# EAGLE design Adafruit IS31FL3731 CharliePlex Grid (EAGLE 6.6.0)
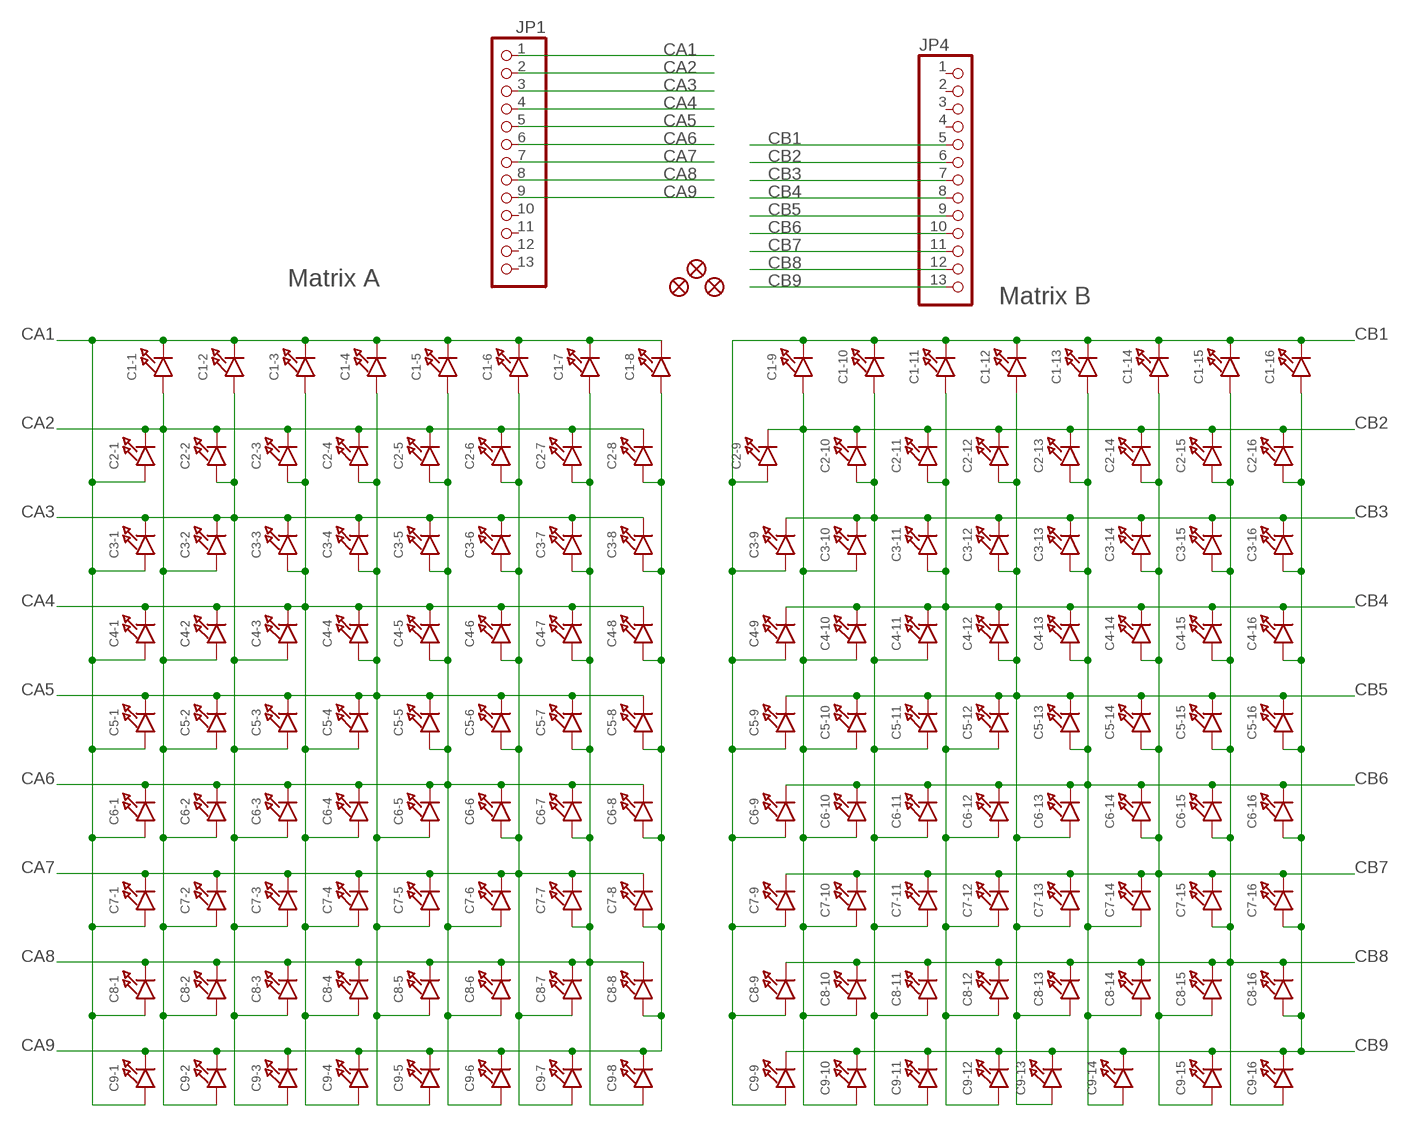
[diagram p0: schematic, sheet 1]

## Parts
C1-1  LED0603_NOOUTLINE  [CHIPLED_0603_NOOUTLINE]
C1-2  LED0603_NOOUTLINE  [CHIPLED_0603_NOOUTLINE]
C1-3  LED0603_NOOUTLINE  [CHIPLED_0603_NOOUTLINE]
C1-4  LED0603_NOOUTLINE  [CHIPLED_0603_NOOUTLINE]
C1-5  LED0603_NOOUTLINE  [CHIPLED_0603_NOOUTLINE]
C1-6  LED0603_NOOUTLINE  [CHIPLED_0603_NOOUTLINE]
C1-7  LED0603_NOOUTLINE  [CHIPLED_0603_NOOUTLINE]
C1-8  LED0603_NOOUTLINE  [CHIPLED_0603_NOOUTLINE]
C1-9  LED0603_NOOUTLINE  [CHIPLED_0603_NOOUTLINE]
C1-10  LED0603_NOOUTLINE  [CHIPLED_0603_NOOUTLINE]
C1-11  LED0603_NOOUTLINE  [CHIPLED_0603_NOOUTLINE]
C1-12  LED0603_NOOUTLINE  [CHIPLED_0603_NOOUTLINE]
C1-13  LED0603_NOOUTLINE  [CHIPLED_0603_NOOUTLINE]
C1-14  LED0603_NOOUTLINE  [CHIPLED_0603_NOOUTLINE]
C1-15  LED0603_NOOUTLINE  [CHIPLED_0603_NOOUTLINE]
C1-16  LED0603_NOOUTLINE  [CHIPLED_0603_NOOUTLINE]
C2-1  LED0603_NOOUTLINE  [CHIPLED_0603_NOOUTLINE]
C2-2  LED0603_NOOUTLINE  [CHIPLED_0603_NOOUTLINE]
C2-3  LED0603_NOOUTLINE  [CHIPLED_0603_NOOUTLINE]
C2-4  LED0603_NOOUTLINE  [CHIPLED_0603_NOOUTLINE]
C2-5  LED0603_NOOUTLINE  [CHIPLED_0603_NOOUTLINE]
C2-6  LED0603_NOOUTLINE  [CHIPLED_0603_NOOUTLINE]
C2-7  LED0603_NOOUTLINE  [CHIPLED_0603_NOOUTLINE]
C2-8  LED0603_NOOUTLINE  [CHIPLED_0603_NOOUTLINE]
C2-9  LED0603_NOOUTLINE  [CHIPLED_0603_NOOUTLINE]
C2-10  LED0603_NOOUTLINE  [CHIPLED_0603_NOOUTLINE]
C2-11  LED0603_NOOUTLINE  [CHIPLED_0603_NOOUTLINE]
C2-12  LED0603_NOOUTLINE  [CHIPLED_0603_NOOUTLINE]
C2-13  LED0603_NOOUTLINE  [CHIPLED_0603_NOOUTLINE]
C2-14  LED0603_NOOUTLINE  [CHIPLED_0603_NOOUTLINE]
C2-15  LED0603_NOOUTLINE  [CHIPLED_0603_NOOUTLINE]
C2-16  LED0603_NOOUTLINE  [CHIPLED_0603_NOOUTLINE]
C3-1  LED0603_NOOUTLINE  [CHIPLED_0603_NOOUTLINE]
C3-2  LED0603_NOOUTLINE  [CHIPLED_0603_NOOUTLINE]
C3-3  LED0603_NOOUTLINE  [CHIPLED_0603_NOOUTLINE]
C3-4  LED0603_NOOUTLINE  [CHIPLED_0603_NOOUTLINE]
C3-5  LED0603_NOOUTLINE  [CHIPLED_0603_NOOUTLINE]
C3-6  LED0603_NOOUTLINE  [CHIPLED_0603_NOOUTLINE]
C3-7  LED0603_NOOUTLINE  [CHIPLED_0603_NOOUTLINE]
C3-8  LED0603_NOOUTLINE  [CHIPLED_0603_NOOUTLINE]
C3-9  LED0603_NOOUTLINE  [CHIPLED_0603_NOOUTLINE]
C3-10  LED0603_NOOUTLINE  [CHIPLED_0603_NOOUTLINE]
C3-11  LED0603_NOOUTLINE  [CHIPLED_0603_NOOUTLINE]
C3-12  LED0603_NOOUTLINE  [CHIPLED_0603_NOOUTLINE]
C3-13  LED0603_NOOUTLINE  [CHIPLED_0603_NOOUTLINE]
C3-14  LED0603_NOOUTLINE  [CHIPLED_0603_NOOUTLINE]
C3-15  LED0603_NOOUTLINE  [CHIPLED_0603_NOOUTLINE]
C3-16  LED0603_NOOUTLINE  [CHIPLED_0603_NOOUTLINE]
C4-1  LED0603_NOOUTLINE  [CHIPLED_0603_NOOUTLINE]
C4-2  LED0603_NOOUTLINE  [CHIPLED_0603_NOOUTLINE]
C4-3  LED0603_NOOUTLINE  [CHIPLED_0603_NOOUTLINE]
C4-4  LED0603_NOOUTLINE  [CHIPLED_0603_NOOUTLINE]
C4-5  LED0603_NOOUTLINE  [CHIPLED_0603_NOOUTLINE]
C4-6  LED0603_NOOUTLINE  [CHIPLED_0603_NOOUTLINE]
C4-7  LED0603_NOOUTLINE  [CHIPLED_0603_NOOUTLINE]
C4-8  LED0603_NOOUTLINE  [CHIPLED_0603_NOOUTLINE]
C4-9  LED0603_NOOUTLINE  [CHIPLED_0603_NOOUTLINE]
C4-10  LED0603_NOOUTLINE  [CHIPLED_0603_NOOUTLINE]
C4-11  LED0603_NOOUTLINE  [CHIPLED_0603_NOOUTLINE]
C4-12  LED0603_NOOUTLINE  [CHIPLED_0603_NOOUTLINE]
C4-13  LED0603_NOOUTLINE  [CHIPLED_0603_NOOUTLINE]
C4-14  LED0603_NOOUTLINE  [CHIPLED_0603_NOOUTLINE]
C4-15  LED0603_NOOUTLINE  [CHIPLED_0603_NOOUTLINE]
C4-16  LED0603_NOOUTLINE  [CHIPLED_0603_NOOUTLINE]
C5-1  LED0603_NOOUTLINE  [CHIPLED_0603_NOOUTLINE]
C5-2  LED0603_NOOUTLINE  [CHIPLED_0603_NOOUTLINE]
C5-3  LED0603_NOOUTLINE  [CHIPLED_0603_NOOUTLINE]
C5-4  LED0603_NOOUTLINE  [CHIPLED_0603_NOOUTLINE]
C5-5  LED0603_NOOUTLINE  [CHIPLED_0603_NOOUTLINE]
C5-6  LED0603_NOOUTLINE  [CHIPLED_0603_NOOUTLINE]
C5-7  LED0603_NOOUTLINE  [CHIPLED_0603_NOOUTLINE]
C5-8  LED0603_NOOUTLINE  [CHIPLED_0603_NOOUTLINE]
C5-9  LED0603_NOOUTLINE  [CHIPLED_0603_NOOUTLINE]
C5-10  LED0603_NOOUTLINE  [CHIPLED_0603_NOOUTLINE]
C5-11  LED0603_NOOUTLINE  [CHIPLED_0603_NOOUTLINE]
C5-12  LED0603_NOOUTLINE  [CHIPLED_0603_NOOUTLINE]
C5-13  LED0603_NOOUTLINE  [CHIPLED_0603_NOOUTLINE]
C5-14  LED0603_NOOUTLINE  [CHIPLED_0603_NOOUTLINE]
C5-15  LED0603_NOOUTLINE  [CHIPLED_0603_NOOUTLINE]
C5-16  LED0603_NOOUTLINE  [CHIPLED_0603_NOOUTLINE]
C6-1  LED0603_NOOUTLINE  [CHIPLED_0603_NOOUTLINE]
C6-2  LED0603_NOOUTLINE  [CHIPLED_0603_NOOUTLINE]
C6-3  LED0603_NOOUTLINE  [CHIPLED_0603_NOOUTLINE]
C6-4  LED0603_NOOUTLINE  [CHIPLED_0603_NOOUTLINE]
C6-5  LED0603_NOOUTLINE  [CHIPLED_0603_NOOUTLINE]
C6-6  LED0603_NOOUTLINE  [CHIPLED_0603_NOOUTLINE]
C6-7  LED0603_NOOUTLINE  [CHIPLED_0603_NOOUTLINE]
C6-8  LED0603_NOOUTLINE  [CHIPLED_0603_NOOUTLINE]
C6-9  LED0603_NOOUTLINE  [CHIPLED_0603_NOOUTLINE]
C6-10  LED0603_NOOUTLINE  [CHIPLED_0603_NOOUTLINE]
C6-11  LED0603_NOOUTLINE  [CHIPLED_0603_NOOUTLINE]
C6-12  LED0603_NOOUTLINE  [CHIPLED_0603_NOOUTLINE]
C6-13  LED0603_NOOUTLINE  [CHIPLED_0603_NOOUTLINE]
C6-14  LED0603_NOOUTLINE  [CHIPLED_0603_NOOUTLINE]
C6-15  LED0603_NOOUTLINE  [CHIPLED_0603_NOOUTLINE]
C6-16  LED0603_NOOUTLINE  [CHIPLED_0603_NOOUTLINE]
C7-1  LED0603_NOOUTLINE  [CHIPLED_0603_NOOUTLINE]
C7-2  LED0603_NOOUTLINE  [CHIPLED_0603_NOOUTLINE]
C7-3  LED0603_NOOUTLINE  [CHIPLED_0603_NOOUTLINE]
C7-4  LED0603_NOOUTLINE  [CHIPLED_0603_NOOUTLINE]
C7-5  LED0603_NOOUTLINE  [CHIPLED_0603_NOOUTLINE]
C7-6  LED0603_NOOUTLINE  [CHIPLED_0603_NOOUTLINE]
C7-7  LED0603_NOOUTLINE  [CHIPLED_0603_NOOUTLINE]
C7-8  LED0603_NOOUTLINE  [CHIPLED_0603_NOOUTLINE]
C7-9  LED0603_NOOUTLINE  [CHIPLED_0603_NOOUTLINE]
C7-10  LED0603_NOOUTLINE  [CHIPLED_0603_NOOUTLINE]
C7-11  LED0603_NOOUTLINE  [CHIPLED_0603_NOOUTLINE]
C7-12  LED0603_NOOUTLINE  [CHIPLED_0603_NOOUTLINE]
C7-13  LED0603_NOOUTLINE  [CHIPLED_0603_NOOUTLINE]
C7-14  LED0603_NOOUTLINE  [CHIPLED_0603_NOOUTLINE]
C7-15  LED0603_NOOUTLINE  [CHIPLED_0603_NOOUTLINE]
C7-16  LED0603_NOOUTLINE  [CHIPLED_0603_NOOUTLINE]
C8-1  LED0603_NOOUTLINE  [CHIPLED_0603_NOOUTLINE]
C8-2  LED0603_NOOUTLINE  [CHIPLED_0603_NOOUTLINE]
C8-3  LED0603_NOOUTLINE  [CHIPLED_0603_NOOUTLINE]
C8-4  LED0603_NOOUTLINE  [CHIPLED_0603_NOOUTLINE]
C8-5  LED0603_NOOUTLINE  [CHIPLED_0603_NOOUTLINE]
C8-6  LED0603_NOOUTLINE  [CHIPLED_0603_NOOUTLINE]
C8-7  LED0603_NOOUTLINE  [CHIPLED_0603_NOOUTLINE]
C8-8  LED0603_NOOUTLINE  [CHIPLED_0603_NOOUTLINE]
C8-9  LED0603_NOOUTLINE  [CHIPLED_0603_NOOUTLINE]
C8-10  LED0603_NOOUTLINE  [CHIPLED_0603_NOOUTLINE]
C8-11  LED0603_NOOUTLINE  [CHIPLED_0603_NOOUTLINE]
C8-12  LED0603_NOOUTLINE  [CHIPLED_0603_NOOUTLINE]
C8-13  LED0603_NOOUTLINE  [CHIPLED_0603_NOOUTLINE]
C8-14  LED0603_NOOUTLINE  [CHIPLED_0603_NOOUTLINE]
C8-15  LED0603_NOOUTLINE  [CHIPLED_0603_NOOUTLINE]
C8-16  LED0603_NOOUTLINE  [CHIPLED_0603_NOOUTLINE]
C9-1  LED0603_NOOUTLINE  [CHIPLED_0603_NOOUTLINE]
C9-2  LED0603_NOOUTLINE  [CHIPLED_0603_NOOUTLINE]
C9-3  LED0603_NOOUTLINE  [CHIPLED_0603_NOOUTLINE]
C9-4  LED0603_NOOUTLINE  [CHIPLED_0603_NOOUTLINE]
C9-5  LED0603_NOOUTLINE  [CHIPLED_0603_NOOUTLINE]
C9-6  LED0603_NOOUTLINE  [CHIPLED_0603_NOOUTLINE]
C9-7  LED0603_NOOUTLINE  [CHIPLED_0603_NOOUTLINE]
C9-8  LED0603_NOOUTLINE  [CHIPLED_0603_NOOUTLINE]
C9-9  LED0603_NOOUTLINE  [CHIPLED_0603_NOOUTLINE]
C9-10  LED0603_NOOUTLINE  [CHIPLED_0603_NOOUTLINE]
C9-11  LED0603_NOOUTLINE  [CHIPLED_0603_NOOUTLINE]
C9-12  LED0603_NOOUTLINE  [CHIPLED_0603_NOOUTLINE]
C9-13  LED0603_NOOUTLINE  [CHIPLED_0603_NOOUTLINE]
C9-14  LED0603_NOOUTLINE  [CHIPLED_0603_NOOUTLINE]
C9-15  LED0603_NOOUTLINE  [CHIPLED_0603_NOOUTLINE]
C9-16  LED0603_NOOUTLINE  [CHIPLED_0603_NOOUTLINE]
FID1  FIDUCIAL""  [FIDUCIAL_1MM]
FID2  FIDUCIAL""  [FIDUCIAL_1MM]
FID3  FIDUCIAL""  [FIDUCIAL_1MM]
JP1  HEADER-1X13  [1X13_ROUND_70]
JP4  HEADER-1X13  [1X13_ROUND_70]

## Nets
CA1: C1-1.C C1-2.C C1-3.C C1-4.C C1-5.C C1-6.C C1-7.C C1-8.C C2-1.A C3-1.A C4-1.A C5-1.A C6-1.A C7-1.A C8-1.A C9-1.A JP1.1
CA2: C1-1.A C2-1.C C2-2.C C2-3.C C2-4.C C2-5.C C2-6.C C2-7.C C2-8.C C3-2.A C4-2.A C5-2.A C6-2.A C7-2.A C8-2.A C9-2.A JP1.2
CA3: C1-2.A C2-2.A C3-1.C C3-2.C C3-3.C C3-4.C C3-5.C C3-6.C C3-7.C C3-8.C C4-3.A C5-3.A C6-3.A C7-3.A C8-3.A C9-3.A JP1.3
CA4: C1-3.A C2-3.A C3-3.A C4-1.C C4-2.C C4-3.C C4-4.C C4-5.C C4-6.C C4-7.C C4-8.C C5-4.A C6-4.A C7-4.A C8-4.A C9-4.A JP1.4
CA5: C1-4.A C2-4.A C3-4.A C4-4.A C5-1.C C5-2.C C5-3.C C5-4.C C5-5.C C5-6.C C5-7.C C5-8.C C6-5.A C7-5.A C8-5.A C9-5.A JP1.5
CA6: C1-5.A C2-5.A C3-5.A C4-5.A C5-5.A C6-1.C C6-2.C C6-3.C C6-4.C C6-5.C C6-6.C C6-7.C C6-8.C C7-6.A C8-6.A C9-6.A JP1.6
CA7: C1-6.A C2-6.A C3-6.A C4-6.A C5-6.A C6-6.A C7-1.C C7-2.C C7-3.C C7-4.C C7-5.C C7-6.C C7-7.C C7-8.C C8-7.A C9-7.A JP1.7
CA8: C1-7.A C2-7.A C3-7.A C4-7.A C5-7.A C6-7.A C7-7.A C8-1.C C8-2.C C8-3.C C8-4.C C8-5.C C8-6.C C8-7.C C8-8.C C9-8.A JP1.8
CA9: C1-8.A C2-8.A C3-8.A C4-8.A C5-8.A C6-8.A C7-8.A C8-8.A C9-1.C C9-2.C C9-3.C C9-4.C C9-5.C C9-6.C C9-7.C C9-8.C JP1.9
CB1: C1-9.C C1-10.C C1-11.C C1-12.C C1-13.C C1-14.C C1-15.C C1-16.C C2-9.A C3-9.A C4-9.A C5-9.A C6-9.A C7-9.A C8-9.A C9-9.A JP4.5
CB2: C1-9.A C2-9.C C2-10.C C2-11.C C2-12.C C2-13.C C2-14.C C2-15.C C2-16.C C3-10.A C4-10.A C5-10.A C6-10.A C7-10.A C8-10.A C9-10.A JP4.6
CB3: C1-10.A C2-10.A C3-9.C C3-10.C C3-11.C C3-12.C C3-13.C C3-14.C C3-15.C C3-16.C C4-11.A C5-11.A C6-11.A C7-11.A C8-11.A C9-11.A JP4.7
CB4: C1-11.A C2-11.A C3-11.A C4-9.C C4-10.C C4-11.C C4-12.C C4-13.C C4-14.C C4-15.C C4-16.C C5-12.A C6-12.A C7-12.A C8-12.A C9-12.A JP4.8
CB5: C1-12.A C2-12.A C3-12.A C4-12.A C5-9.C C5-10.C C5-11.C C5-12.C C5-13.C C5-14.C C5-15.C C5-16.C C6-13.A C7-13.A C8-13.A C9-13.A JP4.9
CB6: C1-13.A C2-13.A C3-13.A C4-13.A C5-13.A C6-9.C C6-10.C C6-11.C C6-12.C C6-13.C C6-14.C C6-15.C C6-16.C C7-14.A C8-14.A C9-14.A JP4.10
CB7: C1-14.A C2-14.A C3-14.A C4-14.A C5-14.A C6-14.A C7-9.C C7-10.C C7-11.C C7-12.C C7-13.C C7-14.C C7-15.C C7-16.C C8-15.A C9-15.A JP4.11
CB8: C1-15.A C2-15.A C3-15.A C4-15.A C5-15.A C6-15.A C7-15.A C8-9.C C8-10.C C8-11.C C8-12.C C8-13.C C8-14.C C8-15.C C8-16.C C9-16.A JP4.12
CB9: C1-16.A C2-16.A C3-16.A C4-16.A C5-16.A C6-16.A C7-16.A C8-16.A C9-9.C C9-10.C C9-11.C C9-12.C C9-13.C C9-14.C C9-15.C C9-16.C JP4.13
Unconnected: JP1.10 JP1.11 JP1.12 JP1.13 JP4.1 JP4.2 JP4.3 JP4.4

## Notes on the sheet
- Matrix A
- Matrix B

## Library data of the parts
C1-1-C1-16 C2-1-C2-16 C3-1-C3-16 C4-1-C4-16 C5-1-C5-16 C6-1-C6-16 C7-1-C7-16 C8-1-C8-16 C9-1-C9-16 = microbuilder:LED: LED 0603 - 0603 Surface Mount Package 2mA: Green LED - Low Power (3.9mcd, 2ma, 1.7Vf) - Digikey: 475-2709-2-ND Orange LED - Low Power (9.8mcd, 2ma, 1.8Vf) - Digikey: 475-1194-2-ND Red LED - Low Power (5mcd, 2ma, 1.8Vf) - Digikey: 475-1195-2-ND Yellow LED - Low Power (7mcd, 2ma, 1.8Vf) - Digikey: 475-1196-2-ND 5mA: Blue LED - Low Power (17mcd, 5ma, 2.9Vf) - Digikey: LNJ937W8CRACT-ND 0805 - 0805 Surface Mount Package 2mA: Red LED (8.8mcd, 2mA, 1.8Vf, Clear) - Low Power [Digikey: 475-2510-1-ND] Green LED (5mcd, 2mA, 1.8Vf, Clear) - Low Power [Digikey: 475-2730-1-ND] Yellow LED (11.3mcd, 2mA, 1.8Vf, Clear) - Low Power [Digikey: 475-2555-1-ND] 20mA: Red LED (104mcd, 20mA, Diffused) - LS R976 [Digikey: 475-1278-6-ND] Red LED (12mcd, 20mA, 2.0Vf, Clear) - APT2012EC [Digikey: 754-1128-1-ND] Green LED (15mcd, 20mA, 2.2Vf, Clear) - APT2012GC [Digikey: 754-1131-1-ND] Orange LED (160mcd, 20mA, 2.1Vf, Clear) - APT2012SECK [Digikey: 754-1130-1-ND] 1206 - 1206 Surface Mount Package Green LED (26mcd, 20mA, Diffused) - LG N971 [Digikey: 475-1407-6-ND] Red LED (15mcd, 20mA, Diffused) - LH N974 [Digikey: 475-1416-6-ND] Cree - Cree High-Power Surface Mount LEDs XPEBWT-L1-0000-00D50 - White 111lm 350mA 2.9Vf 6200K 110° XTEAWT-00-0000-00000LEE3 - White 114lm 350mA 2.85Vf 5000K 115° Everlight - Everlight 45-21 Series Surface Mount LEDs 45-21/QK2C-B2832AC2CB2/2T - Warm White 2000mcd 20mA 3.25Vf 3050K 120° 45-21/LK2C-B38452C4CB2/2T - Nuetral White 2000mcd 20mA 3.25Vf 4150K 120° 45-21/LK2C-B50634C6CB2/2T - Cold White 2200mcd 20mA 3.25Vf 5650K 120° PLCC2 Reverse Mount LS T77K-J1L2-1-0-2-R18-Z - Red 11.25mcd 2mA 1.8Vf 630nm 120° LO T77K-L1M2-24-Z - Orange 19.6mcd 2mA 1.8Vf 606nm 120° LY T77K-K2M1-26-Z - Yellow 15.7mcd 2mA 1.8Vf 587nm 120°
FID1-FID3 = microbuilder:FIDUCIAL: Fiducial Alignment Points Various fiducial points for machine vision alignment.; BOM: EXCLUDE
JP1 JP4 = microbuilder:HEADER-1X13

## Board
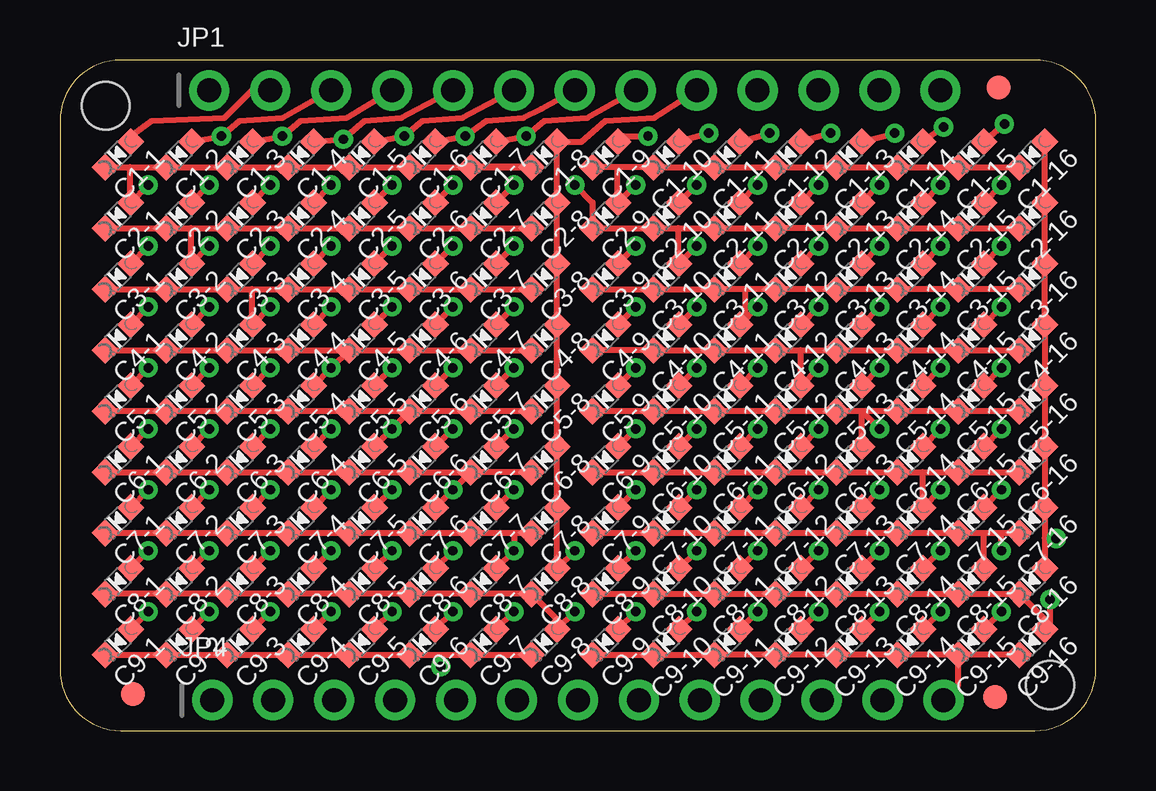
[diagram p1: board, top side]
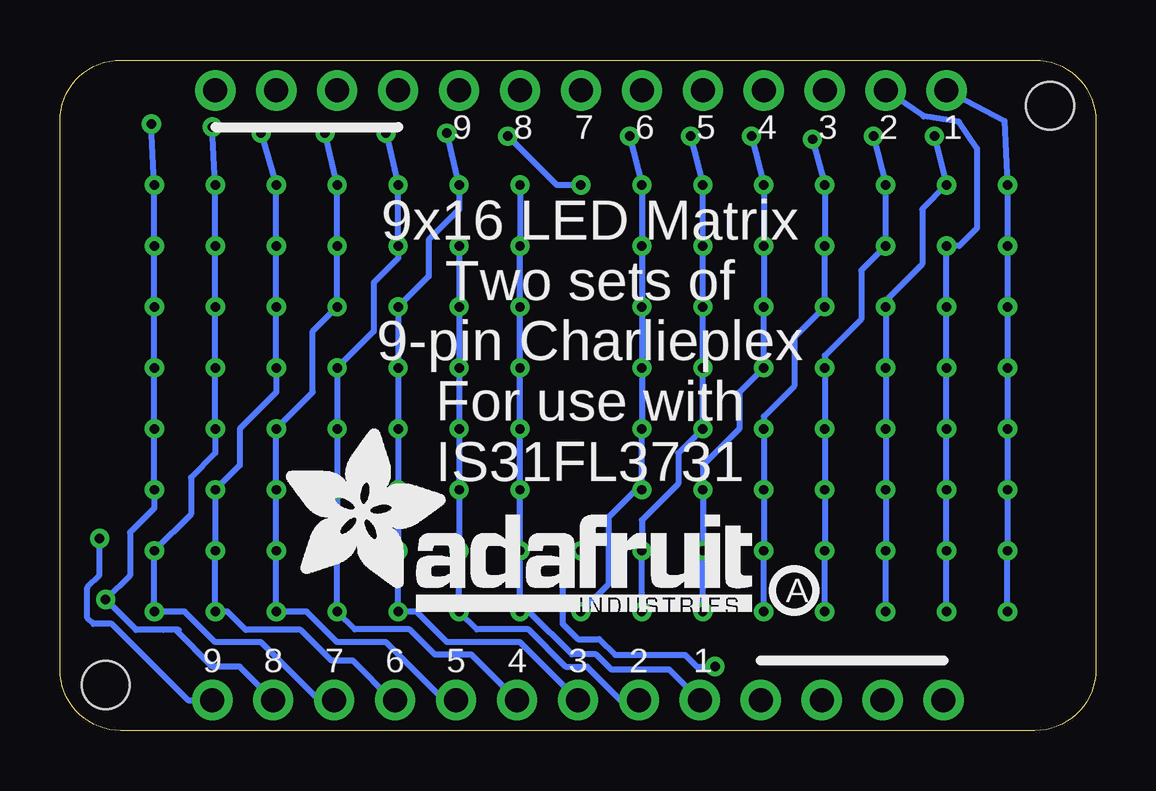
[diagram p2: board, bottom side, seen from below]

Size 43.18 x 27.94 mm. Coordinates in mm from the lower left corner, seen from the top.
Outline: 0,25.4 0,2.54 arc90 2.54,0 40.64,0 arc90 43.18,2.54 43.18,25.4 arc90 40.64,27.94 2.54,27.94 arc90 0,25.4
Copper layers (1*16): Top 0.035mm / dielectric 1.5mm / Bottom 0.035mm
Design rules "adafruit": minimum track width 8mil, minimum drill 15.5mil, track to track 8mil, track to pad 8mil, pad to pad 8mil, via to via 8mil, smd to smd 8mil, copper to edge 10mil, drill to drill 8mil, minimum pad ring 10mil, minimum via ring 8mil, stop-mask expansion 2mil, vias tented up to drill 20mil, thermal gap 10mil
Holes 2 mm at 1.91,26.04 41.27,1.91

### Footprints (pad centres in the part's own frame; a part is rotated, then mirrored left to right if it is on the bottom)
CHIPLED_0603_NOOUTLINE = smd 0.8 x 0.8: A 0,-0.75; C 0,0.75
FIDUCIAL_1MM = smd 1 x 1: 1 0,0
1X13_ROUND_70 = drill 1 pad 1.676: 1 -15.24,0; 2 -12.7,0; 3 -10.16,0; 4 -7.62,0; 5 -5.08,0; 6 -2.54,0; 7 0,0; 8 2.54,0; 9 5.08,0; 10 7.62,0; 11 10.16,0; 12 12.7,0; 13 15.24,0

### Placement (x,y rotation side)
C1-1  2.41,24 135 top
C1-2  4.95,24 135 top
C1-3  7.49,24 135 top
C1-4  10.03,24 135 top
C1-5  12.57,24 135 top
C1-6  15.11,24 135 top
C1-7  17.65,24 135 top
C1-8  20.19,24 135 top
C1-9  22.73,24 135 top
C1-10  25.27,24 135 top
C1-11  27.81,24 135 top
C1-12  30.35,24 135 top
C1-13  32.89,24 135 top
C1-14  35.43,24 135 top
C1-15  37.97,24 135 top
C1-16  40.51,24 135 top
C2-1  2.41,21.46 135 top
C2-2  4.95,21.46 135 top
C2-3  7.49,21.46 135 top
C2-4  10.03,21.46 135 top
C2-5  12.57,21.46 135 top
C2-6  15.11,21.46 135 top
C2-7  17.65,21.46 135 top
C2-8  20.19,21.46 135 top
C2-9  22.73,21.46 135 top
C2-10  25.27,21.46 135 top
C2-11  27.81,21.46 135 top
C2-12  30.35,21.46 135 top
C2-13  32.89,21.46 135 top
C2-14  35.43,21.46 135 top
C2-15  37.97,21.46 135 top
C2-16  40.51,21.46 135 top
C3-1  2.41,18.92 135 top
C3-2  4.95,18.92 135 top
C3-3  7.49,18.92 135 top
C3-4  10.03,18.92 135 top
C3-5  12.57,18.92 135 top
C3-6  15.11,18.92 135 top
C3-7  17.65,18.92 135 top
C3-8  20.19,18.92 135 top
C3-9  22.73,18.92 135 top
C3-10  25.27,18.92 135 top
C3-11  27.81,18.92 135 top
C3-12  30.35,18.92 135 top
C3-13  32.89,18.92 135 top
C3-14  35.43,18.92 135 top
C3-15  37.97,18.92 135 top
C3-16  40.51,18.92 135 top
C4-1  2.41,16.38 135 top
C4-2  4.95,16.38 135 top
C4-3  7.49,16.38 135 top
C4-4  10.03,16.38 135 top
C4-5  12.57,16.38 135 top
C4-6  15.11,16.38 135 top
C4-7  17.65,16.38 135 top
C4-8  20.19,16.38 135 top
C4-9  22.73,16.38 135 top
C4-10  25.27,16.38 135 top
C4-11  27.81,16.38 135 top
C4-12  30.35,16.38 135 top
C4-13  32.89,16.38 135 top
C4-14  35.43,16.38 135 top
C4-15  37.97,16.38 135 top
C4-16  40.51,16.38 135 top
C5-1  2.41,13.84 135 top
C5-2  4.95,13.84 135 top
C5-3  7.49,13.84 135 top
C5-4  10.03,13.84 135 top
C5-5  12.57,13.84 135 top
C5-6  15.11,13.84 135 top
C5-7  17.65,13.84 135 top
C5-8  20.19,13.84 135 top
C5-9  22.73,13.84 135 top
C5-10  25.27,13.84 135 top
C5-11  27.81,13.84 135 top
C5-12  30.35,13.84 135 top
C5-13  32.89,13.84 135 top
C5-14  35.43,13.84 135 top
C5-15  37.97,13.84 135 top
C5-16  40.51,13.84 135 top
C6-1  2.41,11.3 135 top
C6-2  4.95,11.3 135 top
C6-3  7.49,11.3 135 top
C6-4  10.03,11.3 135 top
C6-5  12.57,11.3 135 top
C6-6  15.11,11.3 135 top
C6-7  17.65,11.3 135 top
C6-8  20.19,11.3 135 top
C6-9  22.73,11.3 135 top
C6-10  25.27,11.3 135 top
C6-11  27.81,11.3 135 top
C6-12  30.35,11.3 135 top
C6-13  32.89,11.3 135 top
C6-14  35.43,11.3 135 top
C6-15  37.97,11.3 135 top
C6-16  40.51,11.3 135 top
C7-1  2.41,8.76 135 top
C7-2  4.95,8.76 135 top
C7-3  7.49,8.76 135 top
C7-4  10.03,8.76 135 top
C7-5  12.57,8.76 135 top
C7-6  15.11,8.76 135 top
C7-7  17.65,8.76 135 top
C7-8  20.19,8.76 135 top
C7-9  22.73,8.76 135 top
C7-10  25.27,8.76 135 top
C7-11  27.81,8.76 135 top
C7-12  30.35,8.76 135 top
C7-13  32.89,8.76 135 top
C7-14  35.43,8.76 135 top
C7-15  37.97,8.76 135 top
C7-16  40.51,8.76 135 top
C8-1  2.41,6.22 135 top
C8-2  4.95,6.22 135 top
C8-3  7.49,6.22 135 top
C8-4  10.03,6.22 135 top
C8-5  12.57,6.22 135 top
C8-6  15.11,6.22 135 top
C8-7  17.65,6.22 135 top
C8-8  20.19,6.22 135 top
C8-9  22.73,6.22 135 top
C8-10  25.27,6.22 135 top
C8-11  27.81,6.22 135 top
C8-12  30.35,6.22 135 top
C8-13  32.89,6.22 135 top
C8-14  35.43,6.22 135 top
C8-15  37.97,6.22 135 top
C8-16  40.51,6.22 135 top
C9-1  2.41,3.68 135 top
C9-2  4.95,3.68 135 top
C9-3  7.49,3.68 135 top
C9-4  10.03,3.68 135 top
C9-5  12.57,3.68 135 top
C9-6  15.11,3.68 135 top
C9-7  17.65,3.68 135 top
C9-8  20.19,3.68 135 top
C9-9  22.73,3.68 135 top
C9-10  25.27,3.68 135 top
C9-11  27.81,3.68 135 top
C9-12  30.35,3.68 135 top
C9-13  32.89,3.68 135 top
C9-14  35.43,3.68 135 top
C9-15  37.97,3.68 135 top
C9-16  40.51,3.68 135 top
FID1  39.12,26.8 0 top
FID2  3.05,1.52 0 top
FID3  38.99,1.4 0 top
JP1  21.46,26.67 0 top
JP4  21.59,1.27 0 top
U$1  [PCBFEAT-REV-040]  12.57,5.84 0 bottom
U$2  [ADAFRUIT_TEXT_20MM]  33.91,4.95 0 bottom

### Tracks (layer width: path | path; a pad name or v marks a point on that pad's centre or on a via)
CA1  (via drill 0.39)
  Top 0.254: C1-1.C 2.92,23.47 | 2.92,23.47 C1-2.C C1-3.C C1-4.C C1-5.C C1-6.C C1-7.C | C1-7.C C1-8.C 19.68,23.5 17.14,23.5 C1-7.C | 2.92,23.47 2.92,22.02 C2-1.A v3.68,22.73 | C9-1.A v3.68,4.95 | v3.68,7.49 C8-1.A | C7-1.A v3.68,10.03 | C6-1.A v3.68,12.57 | C5-1.A v3.68,15.11 | C3-1.A v3.68,20.19 | C4-1.A v3.68,17.65
  Bottom 0.254: v3.68,4.95 v3.68,7.49 v3.68,10.03 v3.68,12.57 v3.68,15.11 v3.68,17.65 v3.68,20.19 v3.68,22.73 3.81,25.4 JP1.1
CA2  (via drill 0.39)
  Top 0.254: C2-1.C C2-2.C 5.46,20.93 | 5.46,20.93 C2-3.C C2-4.C C2-5.C C2-6.C C2-7.C C2-8.C | 5.46,20.93 5.46,19.48 C3-2.A v6.22,20.19 | C1-1.A 2.94,24.77 3.83,25.4 6.86,25.53 8,26.67 JP1.2 | C4-2.A v6.22,17.65 | C5-2.A v6.22,15.11 | C6-2.A v6.22,12.57 | C7-2.A v6.22,10.03 | C8-2.A v6.22,7.49 | C9-2.A v6.22,4.95
  Bottom 0.254: v6.22,4.95 v6.22,7.49 v6.22,10.03 v6.22,12.57 v6.22,15.11 v6.22,17.65 v6.22,20.19 5.69,20.19 4.95,20.93 4.95,24.26 5.71,25.36 7.18,25.59 JP1.2
CA3  (via drill 0.39)
  Top 0.254: C3-1.C C3-2.C C3-3.C 8,18.39 | 8,18.39 C3-4.C C3-5.C C3-6.C C3-7.C C3-8.C | 8,18.39 8,16.94 C4-3.A v8.76,17.65 | C1-2.A v6.73,24.77 7.49,25.4 9.27,25.53 JP1.3 | v6.22,22.73 C2-2.A | C9-3.A v8.76,4.95 | v8.76,7.49 C8-3.A | C7-3.A v8.76,10.03 | C6-3.A v8.76,12.57 | C5-3.A v8.76,15.11
  Bottom 0.254: v6.73,24.77 v6.22,22.73 7.24,21.72 7.24,19.43 8.76,17.91 v8.76,17.65 v8.76,15.11 v8.76,12.57 v8.76,10.03 v8.76,7.49 v8.76,4.95
CA4  (via drill 0.39)
  Top 0.254: C4-1.C C4-2.C C4-3.C C4-4.C C4-5.C | C4-5.C C4-6.C C4-7.C C4-8.C | C9-4.A v11.3,4.95 | v11.3,7.49 C8-4.A | C7-4.A v11.3,10.03 | C6-4.A v11.3,12.57 | C5-4.A v11.3,15.11 C4-5.C | C1-3.A v9.27,24.77 10.03,25.4 11.94,25.53 JP1.4 | v8.76,22.73 C2-3.A | C3-3.A v8.76,20.19
  Bottom 0.254: v11.3,4.95 v11.3,7.49 v11.3,10.03 v11.3,12.57 v11.3,15.11 11.3,15.62 9.78,17.14 9.78,19.18 v8.76,20.19 v8.76,22.73 v9.27,24.77
CA5  (via drill 0.39)
  Top 0.254: C5-8.C C5-7.C C5-6.C | C5-6.C C5-5.C C5-4.C C5-3.C C5-2.C C5-1.C | C4-4.A v11.3,17.65 | v11.3,20.19 C3-4.A | C2-4.A v11.3,22.73 | C1-4.A v11.81,24.64 12.7,25.4 14.22,25.53 JP1.5 | C9-5.A v13.84,4.95 | v13.84,7.49 C8-5.A | C7-5.A v13.84,10.03 | C6-5.A v13.84,12.57 C5-6.C
  Bottom 0.254: v11.81,24.64 v11.3,22.73 v11.3,20.19 v11.3,17.65 12.57,16.38 12.57,14.35 13.84,13.08 v13.84,12.57 v13.84,10.03 v13.84,7.49 v13.84,4.95
CA6  (via drill 0.39)
  Top 0.254: C6-8.C C6-7.C | C6-1.C C6-2.C C6-3.C C6-4.C C6-5.C C6-6.C C6-7.C | C5-5.A v13.84,15.11 | v13.84,17.65 C4-5.A | C3-5.A v13.84,20.19 | C2-5.A v13.84,22.73 | C1-5.A v14.35,24.77 15.11,25.4 16.76,25.53 JP1.6 | C7-6.A v16.38,10.03 C6-7.C | v16.38,7.49 C8-6.A | C9-6.A v16.38,4.95
  Bottom 0.254: v14.35,24.77 v13.84,22.73 v13.84,20.19 v13.84,17.65 v13.84,15.11 14.86,14.1 14.86,12.57 16.38,11.05 v16.38,10.03 v16.38,7.49 v16.38,4.95
CA7  (via drill 0.39)
  Top 0.254: C7-1.C C7-2.C C7-3.C C7-4.C C7-5.C C7-6.C C7-7.C 18.93,8.23 | 18.93,8.23 C7-8.C | C1-6.A v16.89,24.77 17.78,25.4 19.3,25.53 20.07,25.91 JP1.7 | v16.38,22.73 C2-6.A | C3-6.A v16.38,20.19 | C4-6.A v16.38,17.65 | C5-6.A v16.38,15.11 | C6-6.A v16.38,12.57 | C9-7.A v18.92,4.95 | C8-7.A v18.92,7.49 18.92,8.22 18.93,8.23
  Bottom 0.254: v16.89,24.77 v16.38,22.73 v16.38,20.19 v16.38,17.65 v16.38,15.11 v16.38,12.57 17.4,11.56 17.4,10.29 18.92,8.76 v18.92,7.49 v18.92,4.95
CA8  (via drill 0.39)
  Top 0.254: C8-1.C C8-2.C C8-3.C C8-4.C C8-5.C C8-6.C C8-7.C C8-8.C 20.72,4.63 C9-8.A v21.46,4.95 | C7-7.A v18.92,10.03 | v18.92,12.57 C6-7.A | C5-7.A v18.92,15.11 | C4-7.A v18.92,17.65 | C3-7.A v18.92,20.19 | C2-7.A v18.92,22.73 | C1-7.A v19.43,24.77 20.19,25.4 21.97,25.53 JP1.8
  Bottom 0.254: v18.92,10.03 18.92,10.29 | 18.92,10.29 v18.92,12.57 v18.92,15.11 v18.92,17.65 v18.92,20.19 v18.92,22.73 v19.43,24.77 | 18.92,10.29 20.3,8.91 20.3,6.12 v21.46,4.95
CA9  (via drill 0.39)
  Top 0.254: C9-1.C C9-2.C C9-3.C C9-4.C C9-5.C C9-6.C 16,3.15 | 16,3.15 C9-7.C C9-8.C 19.64,3.43 | v21.46,7.49 C8-8.A C7-8.A C6-8.A C5-8.A C4-8.A C3-8.A C2-8.A C1-8.A 21.74,24.53 22.73,25.4 24.77,25.53 JP1.9 | 16,3.15 15.88,3.03 v15.88,2.67
  Bottom 0.254: v21.46,7.49 21.72,7.49 22.23,6.99 22.23,4.45 21.59,3.81 20.7,3.81 20.04,3.15 C9-7.C 16.64,2.67 v15.88,2.67
CB1  (via drill 0.39)
  Top 0.254: C1-16.C C1-15.C C1-14.C C1-13.C C1-12.C C1-11.C C1-10.C 23.24,23.47 | 23.24,23.47 C1-9.C | 23.24,23.47 23.24,22.02 C2-9.A v24,22.73 | v24,20.19 C3-9.A | C4-9.A v24,17.65 | C5-9.A v24,15.11 | C6-9.A v24,12.57 | C7-9.A v24,10.03 | C8-9.A v24,7.49 | C9-9.A v24,4.95
  Bottom 0.254: v24,22.73 v24,20.19 v24,17.65 v24,15.11 v24,12.57 v24,10.03 v24,7.49 v24,4.95 23.62,4.95 21.84,3.17 20.83,3.17 20.19,2.54 17.78,2.54 JP4.5
CB2  (via drill 0.39)
  Top 0.254: C2-16.C C2-15.C C2-14.C C2-13.C C2-12.C C2-11.C 25.78,20.93 | 25.78,20.93 C2-10.C C2-9.C 22.2,21.99 v21.46,22.73 | 25.78,20.93 25.78,19.48 C3-10.A v26.54,20.19 | C9-10.A v26.54,4.95 | v26.54,7.49 C8-10.A | C7-10.A v26.54,10.03 | C6-10.A v26.54,12.57 | C5-10.A v26.54,15.11 | C4-10.A v26.54,17.65 | C1-9.A 23.5,24.77 v24.51,24.77
  Bottom 0.254: v26.54,20.19 v26.54,17.65 v26.54,15.11 v26.54,12.57 v26.54,10.03 v26.54,7.49 v26.54,4.95 C9-10.A 23.64,4.21 22.1,2.67 21.21,2.67 19.81,1.27 JP4.6 | v24.51,24.77 22.48,22.73 v21.46,22.73
CB3  (via drill 0.39)
  Top 0.254: C3-16.C C3-15.C C3-14.C C3-13.C C3-12.C 28.57,18.39 | 28.57,18.39 C3-11.C C3-10.C C3-9.C | 28.57,18.39 28.57,17.14 C4-11.A v29.08,17.65 | C9-11.A v29.08,4.95 | v29.08,7.49 C8-11.A | C7-11.A v29.08,10.03 | C6-11.A v29.08,12.57 | C5-11.A v29.08,15.11 | C2-10.A v26.54,22.73 | v27.05,24.89 C1-10.A
  Bottom 0.254: v27.05,24.89 v26.54,22.73 26.54,21.72 27.81,20.45 27.81,18.92 v29.08,17.65 v29.08,15.11 v29.08,12.57 v29.08,10.03 v29.08,7.49 v29.08,4.95 28.32,4.95 27.05,3.68 24,3.68 JP4.7
CB4  (via drill 0.39)
  Top 0.254: 30.88,15.85 C4-12.C C4-11.C C4-10.C C4-9.C | 30.88,15.85 C4-13.C C4-14.C C4-15.C C4-16.C | C1-11.A v29.59,24.89 | v29.08,22.73 C2-11.A | C3-11.A v29.08,20.19 | 30.88,15.85 C5-12.A v31.62,15.11 | C9-12.A v31.62,4.95 | v31.62,7.49 C8-12.A | C7-12.A v31.62,10.03 | C6-12.A v31.62,12.57
  Bottom 0.254: v29.59,24.89 v29.08,22.73 v29.08,20.19 29.08,19.68 30.1,18.67 30.1,16.64 v31.62,15.11 v31.62,12.57 v31.62,10.03 v31.62,7.49 v31.62,4.95 C9-12.A 28.6,4.21 27.56,3.17 26.04,3.17 JP4.8
CB5  (via drill 0.39)
  Top 0.254: C4-12.A v31.62,17.65 | v32.13,24.89 C1-12.A | C2-12.A v31.62,22.73 | C3-12.A v31.62,20.19 | C5-16.C C5-15.C C5-14.C 33.42,13.31 | 33.42,13.31 C5-13.C C5-12.C C5-11.C C5-10.C C5-9.C | C6-13.A 33.42,13.31 | C9-13.A v34.16,4.95 | v34.16,12.57 33.42,13.31 | 33.42,13.31 | C7-13.A v34.16,10.03 | C8-13.A v34.16,7.49
  Bottom 0.254: v32.13,24.89 v31.62,22.73 v31.62,20.19 v31.62,17.65 32.64,16.64 32.64,14.1 v34.16,12.57 v34.16,10.03 v34.16,7.49 v34.16,4.95 32.89,4.95 31.62,3.68 29.59,3.68 27.18,1.27 JP4.9
CB6  (via drill 0.39)
  Top 0.254: C1-13.A v34.8,24.89 | v34.16,22.73 C2-13.A | C3-13.A v34.16,20.19 | C4-13.A v34.16,17.65 | C6-9.C C6-10.C C6-11.C C6-12.C C6-13.C C6-14.C 35.96,10.77 | 35.96,10.77 C6-15.C C6-16.C | 35.96,10.77 C7-14.A v36.7,10.03 | v36.7,7.49 C8-14.A | C9-14.A v36.7,4.95 | C5-13.A v34.16,15.11
  Bottom 0.254: v34.8,24.89 v34.16,22.73 v34.16,20.19 v34.16,17.65 v34.16,15.11 34.16,14.1 35.69,12.57 35.69,11.05 v36.7,10.03 v36.7,7.49 v36.7,4.95 36.2,4.95 35.43,4.19 33.15,4.19 31.88,2.92 30.99,2.92 29.34,1.27 JP4.10
CB7  (via drill 0.39)
  Top 0.254: C4-14.A v36.7,17.65 | v36.83,25.15 C1-14.A | C2-14.A v36.7,22.73 | C3-14.A v36.7,20.19 | C7-9.C C7-10.C C7-11.C C7-12.C C7-13.C C7-14.C C7-15.C 38.5,8.23 | 38.5,8.23 39.24,8.23 | 39.24,8.23 C7-16.C | C8-15.A 38.5,8.23 | C9-15.A v39.24,4.95 | v39.24,7.49 39.24,8.23 | C6-14.A v36.7,12.57 | v36.7,15.11 C5-14.A
  Bottom 0.254: v36.83,25.15 v36.7,22.73 v36.7,20.19 v36.7,17.65 v36.7,15.11 v36.7,12.57 36.7,11.56 37.72,10.54 37.72,9.02 v39.24,7.49 v39.24,4.95 37.97,4.95 36.7,3.68 34.8,3.68 32.38,1.27 JP4.11
CB8  (via drill 0.39)
  Top 0.254: C4-15.A v39.24,17.65 | v39.37,25.27 C1-15.A | C3-15.A v39.24,20.19 | C2-15.A v39.24,22.73 | C8-9.C C8-10.C C8-11.C C8-12.C C8-13.C C8-14.C C8-15.C | C8-15.C C8-16.C 41.04,4.63 C9-16.A 41.27,4.45 v41.27,5.46 | C8-15.C 37.21,5.92 | v39.24,10.03 C7-15.A | C6-15.A v39.24,12.57 | C5-15.A v39.24,15.11
  Bottom 0.254: v39.37,25.27 v39.24,22.73 v39.24,20.19 v39.24,17.65 v39.24,15.11 v39.24,12.57 v39.24,10.03 39.24,9.27 40.26,8.26 40.26,6.48 v41.27,5.46 40.01,4.19 38.86,4.19 38.35,4.19 | 38.23,4.19 38.35,4.19 | JP4.12 35.69,2.67 36.83,2.67 38.35,4.19
CB9  (via drill 0.39)
  Top 0.254: C1-16.A C2-16.A C3-16.A C4-16.A C5-16.A C6-16.A C7-16.A 41.04,8.02 | C9-9.C C9-10.C C9-11.C C9-12.C C9-13.C C9-14.C C9-15.C | C9-16.C C9-15.C | v41.53,8 41.04,8.02 | 41.04,8.02 C8-16.A | JP4.13 37.44,1.88 C9-15.C
  Bottom 0.254: v41.53,8 41.53,6.48 42.04,5.97 42.04,4.7 41.78,4.45 41.02,4.45 37.85,1.27 JP4.13

### Text on the board
bPlace: 1 | 2 | 3 | 4 | 5 | 6 | 7 | 8 | 9 | 9x16 LED Matrix / Two sets of / 9-pin Charlieplex / For use with / IS31FL3731 | 1 | 2 | 3 | 4 | 5 | 6 | 7 | 8 | 9